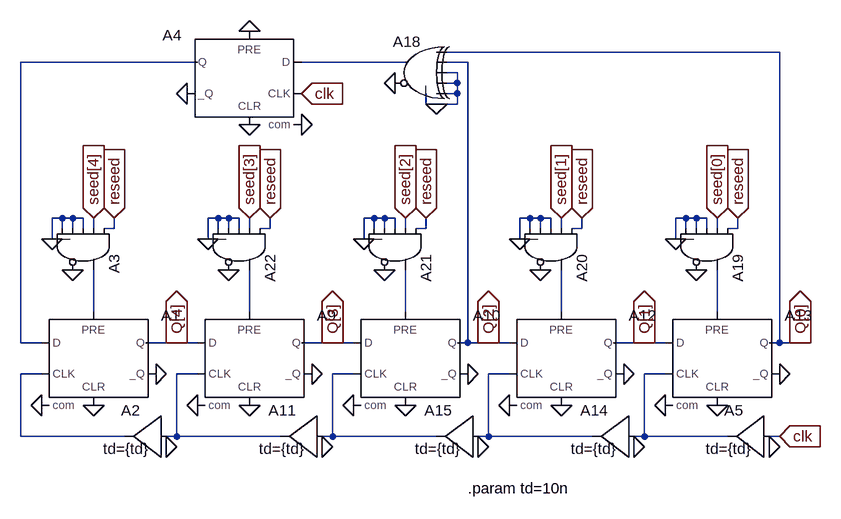
[diagram p0: schematic lfsr_5bit.asc]
lfsr_5bit.asc, the LTspice schematic file:
Version 4
SHEET 1 2204 680
WIRE 1920 -352 1408 -352
WIRE 1024 -336 752 -336
WIRE 1344 -336 1184 -336
WIRE 1440 -336 1408 -336
WIRE 1424 -320 1408 -320
WIRE 1424 -304 1424 -320
WIRE 1424 -304 1408 -304
WIRE 1424 -288 1424 -304
WIRE 1424 -288 1408 -288
WIRE 1376 -272 1376 -288
WIRE 1392 -272 1376 -272
WIRE 1424 -272 1424 -288
WIRE 1424 -272 1392 -272
WIRE 816 -96 800 -96
WIRE 832 -96 816 -96
WIRE 848 -96 832 -96
WIRE 1056 -96 1040 -96
WIRE 1072 -96 1056 -96
WIRE 1088 -96 1072 -96
WIRE 1296 -96 1280 -96
WIRE 1312 -96 1296 -96
WIRE 1328 -96 1312 -96
WIRE 1536 -96 1520 -96
WIRE 1552 -96 1536 -96
WIRE 1568 -96 1552 -96
WIRE 1776 -96 1760 -96
WIRE 1792 -96 1776 -96
WIRE 1808 -96 1792 -96
WIRE 816 -80 816 -96
WIRE 832 -80 832 -96
WIRE 848 -80 848 -96
WIRE 864 -80 864 -96
WIRE 896 -80 896 -96
WIRE 896 -80 880 -80
WIRE 1056 -80 1056 -96
WIRE 1072 -80 1072 -96
WIRE 1088 -80 1088 -96
WIRE 1104 -80 1104 -96
WIRE 1136 -80 1136 -96
WIRE 1136 -80 1120 -80
WIRE 1296 -80 1296 -96
WIRE 1312 -80 1312 -96
WIRE 1328 -80 1328 -96
WIRE 1344 -80 1344 -96
WIRE 1376 -80 1376 -96
WIRE 1376 -80 1360 -80
WIRE 1536 -80 1536 -96
WIRE 1552 -80 1552 -96
WIRE 1568 -80 1568 -96
WIRE 1584 -80 1584 -96
WIRE 1616 -80 1616 -96
WIRE 1616 -80 1600 -80
WIRE 1776 -80 1776 -96
WIRE 1792 -80 1792 -96
WIRE 1808 -80 1808 -96
WIRE 1824 -80 1824 -96
WIRE 1856 -80 1856 -96
WIRE 1856 -80 1840 -80
WIRE 800 -64 800 -96
WIRE 816 -64 800 -64
WIRE 1040 -64 1040 -96
WIRE 1056 -64 1040 -64
WIRE 1280 -64 1280 -96
WIRE 1296 -64 1280 -64
WIRE 1520 -64 1520 -96
WIRE 1536 -64 1520 -64
WIRE 1760 -64 1760 -96
WIRE 1776 -64 1760 -64
WIRE 864 48 864 -16
WIRE 1104 48 1104 -16
WIRE 1344 48 1344 -16
WIRE 1584 48 1584 -16
WIRE 1824 48 1824 -16
WIRE 752 96 752 -336
WIRE 784 96 752 96
WIRE 992 96 944 96
WIRE 1024 96 992 96
WIRE 1232 96 1184 96
WIRE 1264 96 1232 96
WIRE 1440 96 1440 -336
WIRE 1440 96 1424 96
WIRE 1472 96 1440 96
WIRE 1504 96 1472 96
WIRE 1712 96 1664 96
WIRE 1744 96 1712 96
WIRE 1920 96 1920 -352
WIRE 1920 96 1904 96
WIRE 1952 96 1920 96
WIRE 1968 96 1952 96
WIRE 784 144 752 144
WIRE 1024 144 992 144
WIRE 1264 144 1232 144
WIRE 1504 144 1472 144
WIRE 1744 144 1712 144
WIRE 752 240 752 144
WIRE 912 240 752 240
WIRE 992 240 992 144
WIRE 992 240 976 240
WIRE 1152 240 992 240
WIRE 1232 240 1232 144
WIRE 1232 240 1216 240
WIRE 1392 240 1232 240
WIRE 1472 240 1472 144
WIRE 1472 240 1456 240
WIRE 1632 240 1472 240
WIRE 1712 240 1712 144
WIRE 1712 240 1696 240
WIRE 1840 240 1712 240
WIRE 1920 240 1904 240
FLAG 1200 144 0
FLAG 1440 144 0
FLAG 1264 192 0
FLAG 1024 192 0
FLAG 1104 192 0
FLAG 1344 192 0
FLAG 1216 256 0
FLAG 1232 96 Q[3]
IOPIN 1232 96 Out
FLAG 1680 144 0
FLAG 1744 192 0
FLAG 1504 192 0
FLAG 1584 192 0
FLAG 1824 192 0
FLAG 1696 256 0
FLAG 1712 96 Q[1]
IOPIN 1712 96 Out
FLAG 1456 256 0
FLAG 1472 96 Q[2]
IOPIN 1472 96 Out
FLAG 1920 144 0
FLAG 1952 96 Q[0]
IOPIN 1952 96 Out
FLAG 1920 240 clk
IOPIN 1920 240 In
FLAG 1392 -272 0
FLAG 1328 -304 0
FLAG 1824 -96 seed[0]
IOPIN 1824 -96 In
FLAG 1584 -96 seed[1]
IOPIN 1584 -96 In
FLAG 1344 -96 seed[2]
IOPIN 1344 -96 In
FLAG 1104 -96 seed[3]
IOPIN 1104 -96 In
FLAG 1792 -16 0
FLAG 1760 -64 0
FLAG 1856 -96 reseed
IOPIN 1856 -96 In
FLAG 1552 -16 0
FLAG 1520 -64 0
FLAG 1616 -96 reseed
IOPIN 1616 -96 In
FLAG 1312 -16 0
FLAG 1280 -64 0
FLAG 1376 -96 reseed
IOPIN 1376 -96 In
FLAG 1072 -16 0
FLAG 1040 -64 0
FLAG 1136 -96 reseed
IOPIN 1136 -96 In
FLAG 960 144 0
FLAG 784 192 0
FLAG 864 192 0
FLAG 976 256 0
FLAG 992 96 Q[4]
IOPIN 992 96 Out
FLAG 864 -96 seed[4]
IOPIN 864 -96 In
FLAG 832 -16 0
FLAG 800 -64 0
FLAG 896 -96 reseed
IOPIN 896 -96 In
FLAG 1008 -288 0
FLAG 1184 -240 0
FLAG 1104 -240 0
FLAG 1904 256 0
FLAG 1184 -288 clk
IOPIN 1184 -288 In
FLAG 1104 -384 0
SYMBOL Digital\\dflop 1104 48 R0
SYMATTR InstName A9
SYMBOL Digital\\dflop 1344 48 R0
SYMATTR InstName A10
SYMBOL Digital\\buf1 1216 176 M0
WINDOW 3 26 83 Left 2
SYMATTR Value td={td}
SYMATTR InstName A11
SYMBOL Digital\\dflop 1584 48 R0
SYMATTR InstName A12
SYMBOL Digital\\dflop 1824 48 R0
SYMATTR InstName A13
SYMBOL Digital\\buf1 1696 176 M0
WINDOW 3 26 83 Left 2
SYMATTR Value td={td}
SYMATTR InstName A14
SYMBOL Digital\\buf1 1456 176 M0
WINDOW 3 26 83 Left 2
SYMATTR Value td={td}
SYMATTR InstName A15
SYMBOL Digital\\xor 1360 -384 M0
SYMATTR InstName A18
SYMBOL Digital\\and 1872 -48 R90
SYMATTR InstName A19
SYMBOL Digital\\and 1632 -48 R90
SYMATTR InstName A20
SYMBOL Digital\\and 1392 -48 R90
SYMATTR InstName A21
SYMBOL Digital\\and 1152 -48 R90
SYMATTR InstName A22
SYMBOL Digital\\dflop 864 48 R0
SYMATTR InstName A1
SYMBOL Digital\\buf1 976 176 M0
WINDOW 3 26 83 Left 2
SYMATTR Value td={td}
SYMATTR InstName A2
SYMBOL Digital\\and 912 -48 R90
SYMATTR InstName A3
SYMBOL Digital\\dflop 1104 -384 M0
SYMATTR InstName A4
SYMBOL Digital\\buf1 1904 176 M0
WINDOW 3 26 83 Left 2
SYMATTR Value td={td}
SYMATTR InstName A5
TEXT 1440 320 Left 2 !.param td=10n

The netlist it stands for:
* lfsr_5bit.asc
A9 Q[4] 0 N009 N004 0 0 Q[3] 0 DFLOP
A10 Q[3] 0 N010 N005 0 0 Q[2] 0 DFLOP
A11 N010 0 0 0 0 0 N009 0 BUF td={td}
A12 Q[2] 0 N011 N006 0 0 Q[1] 0 DFLOP
A13 Q[1] 0 N012 N007 0 0 Q[0] 0 DFLOP
A14 N012 0 0 0 0 0 N011 0 BUF td={td}
A15 N011 0 0 0 0 0 N010 0 BUF td={td}
A18 Q[0] Q[2] 0 0 0 0 N002 0 XOR
A19 reseed seed[0] 0 0 0 0 N007 0 AND
A20 reseed seed[1] 0 0 0 0 N006 0 AND
A21 reseed seed[2] 0 0 0 0 N005 0 AND
A22 reseed seed[3] 0 0 0 0 N004 0 AND
A1 N001 0 N008 N003 0 0 Q[4] 0 DFLOP
A2 N009 0 0 0 0 0 N008 0 BUF td={td}
A3 reseed seed[4] 0 0 0 0 N003 0 AND
A4 N002 0 clk 0 0 0 N001 0 DFLOP
A5 clk 0 0 0 0 0 N012 0 BUF td={td}
.param td=10n
.backanno
.end